# EasyEDA schematic SCH_speedometer_2024-07-09.json
TITLE: Sheet_1; REV: 1.0; Date: 2024-07-07; Sheet: 1/1; Company: Your Company
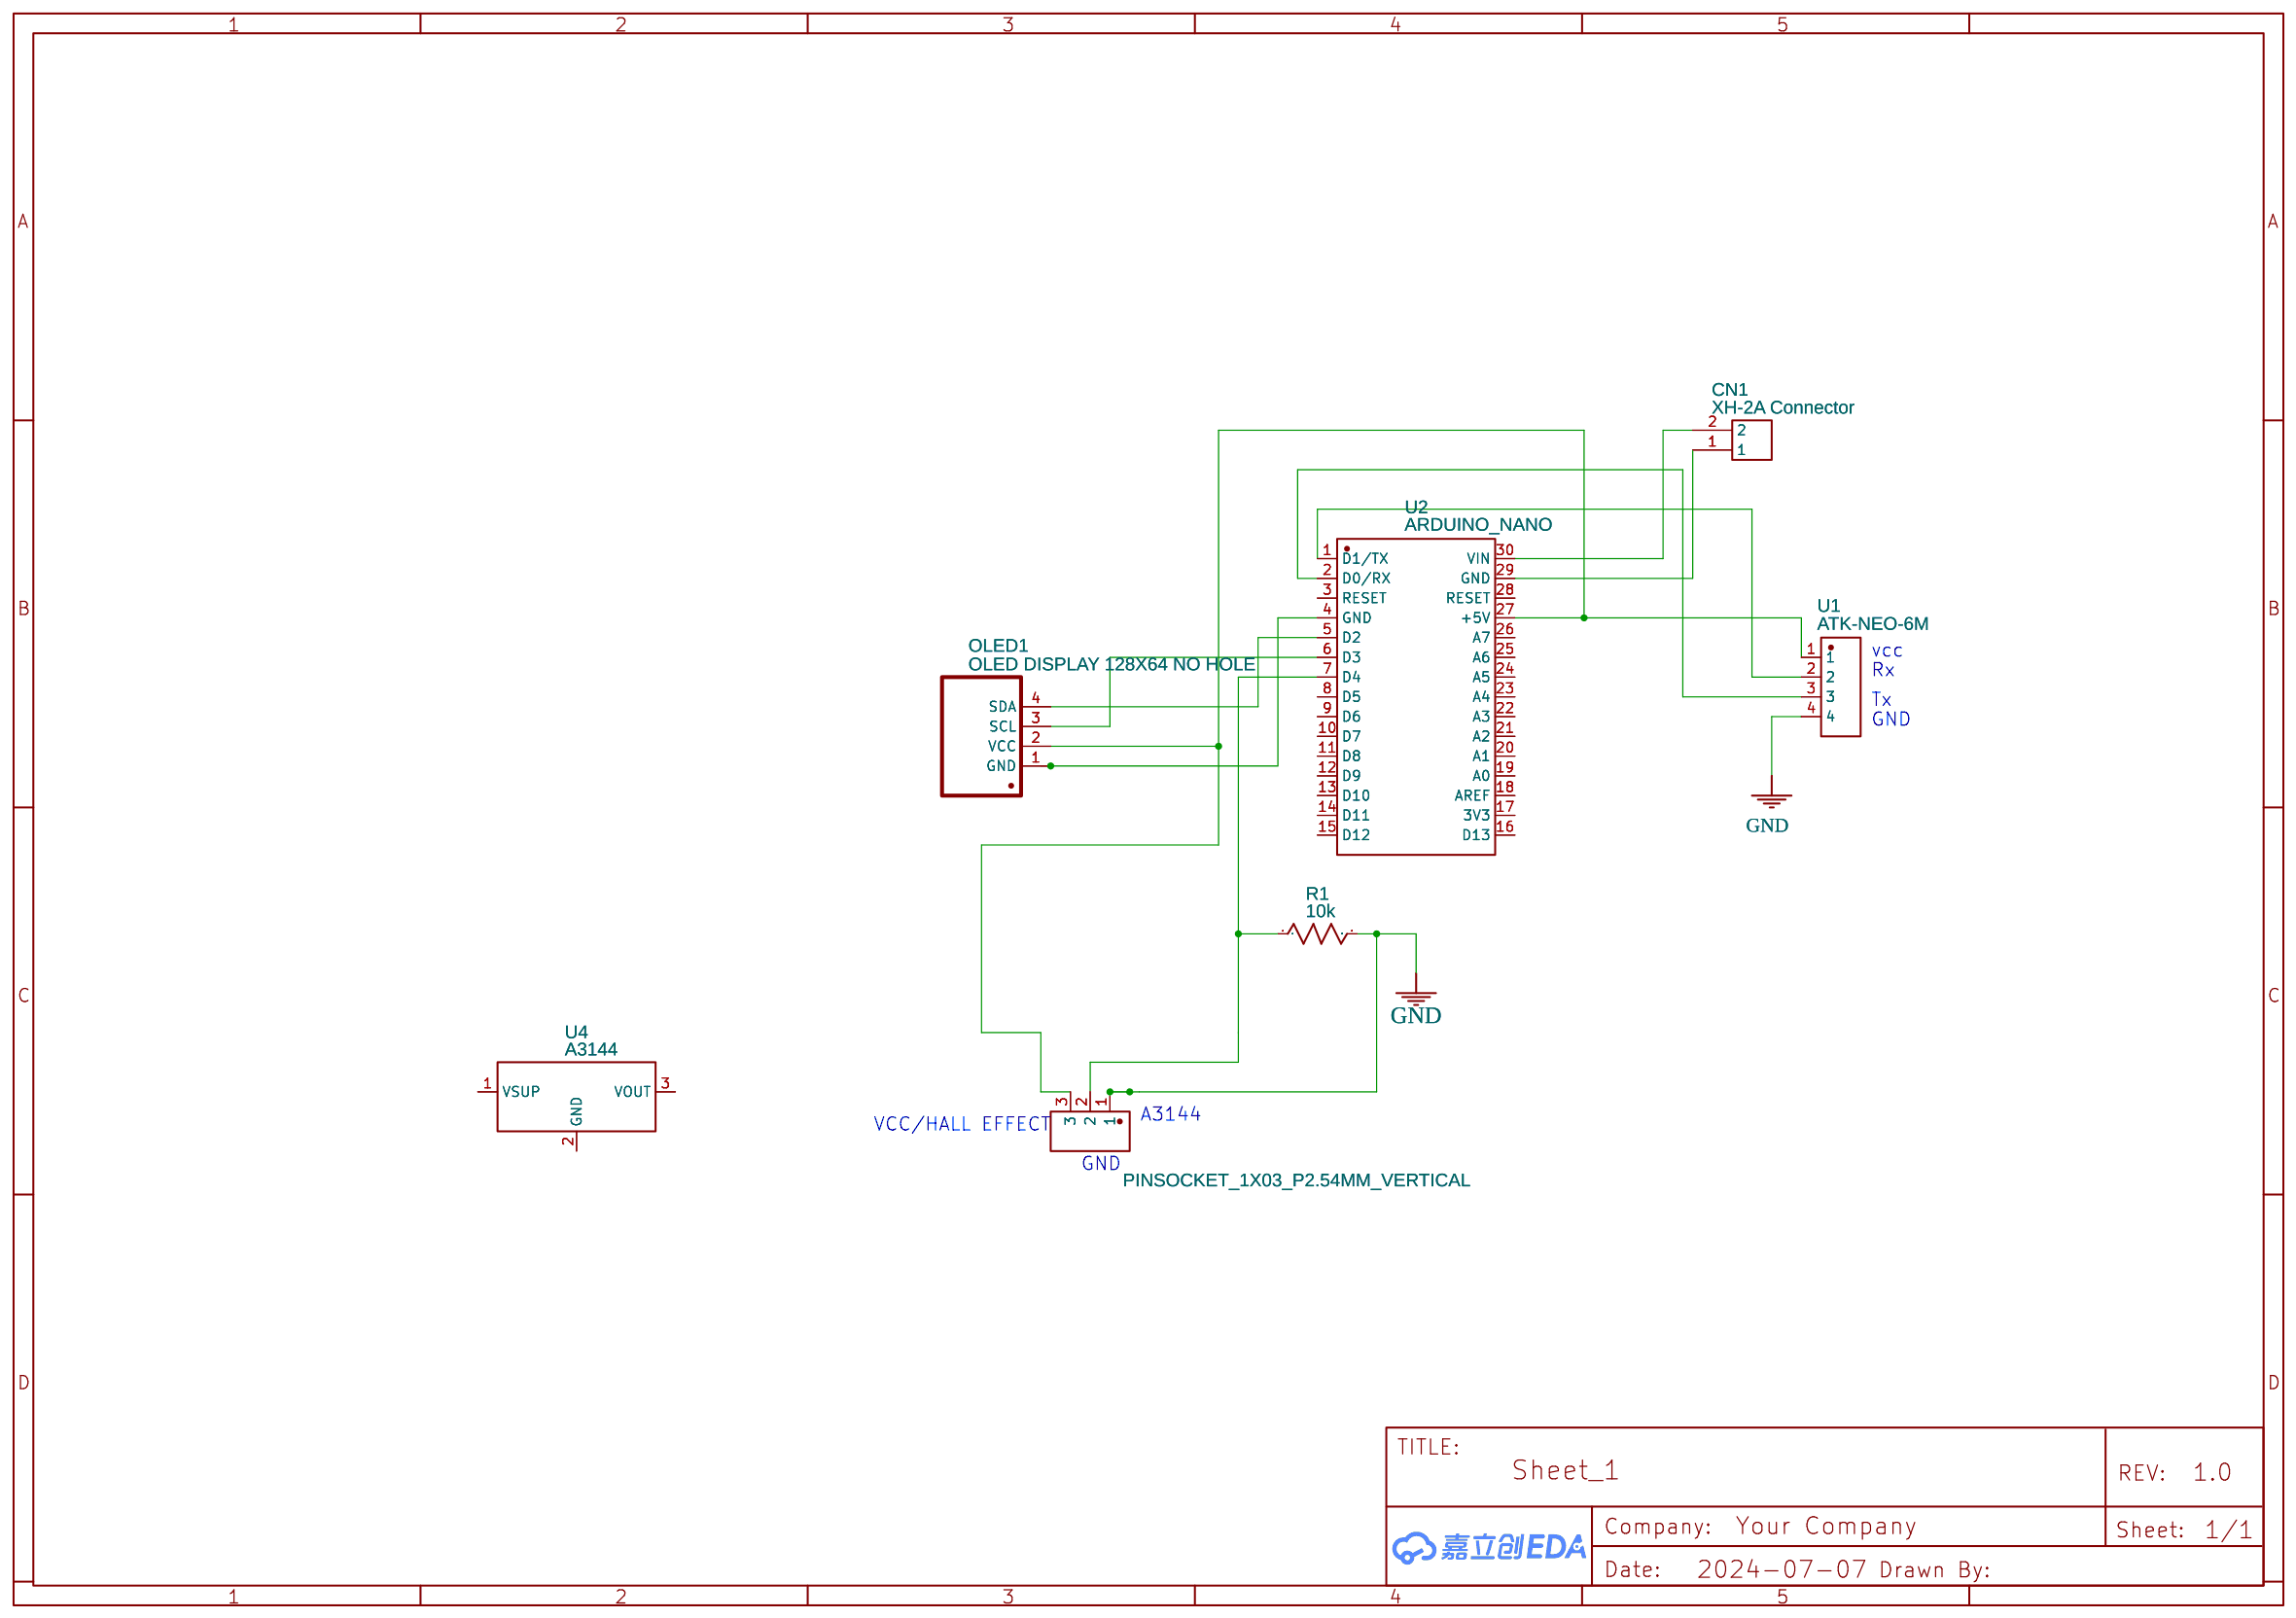
[diagram p0: schematic sheet]

## Parts
1  PINSOCKET_1X03_P2.54MM_VERTICAL  [HDR-TH_3P-P2.54-V-F]
CN1  XH-2A Connector  [XH CONNECTOR]
OLED1  OLED DISPLAY 128X64 NO HOLE  [0.96-OLED-DISPLAY]
R1  10k  [R0603]
U1  ATK-NEO-6M  [TH_ATK-NEO-6M]
U2  ARDUINO_NANO  [COMM-TH_ARDUINO_NANO]
U4  A3144  [SOT-23-3_L2.9-W1.6-P1.90-LS2.8-BR-CW]

## Library data of the parts
1 = PINSOCKET_1X03_P2.54MM_VERTICAL: LINK: https://img.jlc.com/pdf/applyPasteComponent/2021-11-29/208559D/b25eee3aee4e4e7ea894ac6be7827652/PM254-1x3.pdf; Contributor: LCSC; Supplier: LCSC; Supplier Part: C9900002703; Manufacturer: null
CN1 = XH-2A Connector: Manufacturer: BOOMELE; Manufacturer Part: XHB-2A Connector; image: //image.lceda.cn/szlcsc/C57981.jpg; Supplier Part: C57981; Contributor: Cisss
OLED1 = OLED DISPLAY 128X64 NO HOLE: Contributor: iloveelectronics
R1 = R_0603_US: Contributor: LCEDA_Lib
U1 = ATK-NEO-6M: Contributor: lcsc; Supplier: LCSC; Supplier Part: C9900025554; Manufacturer: null
U2 = ARDUINO_NANO: Contributor: lcsc; Supplier: LCSC; Supplier Part: C9900017879; Manufacturer: null; JLCPCB Part Class: Extended Part
U4 = A3144: Supplier: LCSC; Supplier Part: C18221460; Manufacturer: JSMSEMI(杰盛微); Contributor: lcsc; JLCPCB Part Class: Extended Part

## Nets
GND: 1.1 R1.2 U1.4
Net-(1-2): 1.2 R1.1 U2.7(D4)
Net-(1-3): 1.3 OLED1.2(VCC) U1.1 U2.27(+5V)
Net-(CN1-1): CN1.1 U2.29(GND)
Net-(CN1-2): CN1.2 U2.30(VIN)
Net-(OLED1-1): OLED1.1(GND) U2.4(GND)
Net-(OLED1-3): OLED1.3(SCL) U2.6(D3)
Net-(OLED1-4): OLED1.4(SDA) U2.5(D2)
Net-(U1-2): U1.2 U2.1(D1/TX)
Net-(U1-3): U1.3 U2.2(D0/RX)

Not connected (* = marked no-connect by the designer): U2 3(RESET) 8(D5) 9(D6) 10(D7) 11(D8) 12(D9) 13(D10) 14(D11) 15(D12) 16(D13) 17(3V3) 18(AREF) 19(A0) 20(A1) 21(A2) 22(A3) 23(A4) 24(A5) 25(A6) 26(A7) 28(RESET); U4 1(VSUP) 2(GND) 3(VOUT)

## Notes on the sheet
- vcc
- Rx
- Tx
- GND
- VCC/HALL EFFECT
- A3144
- GND
